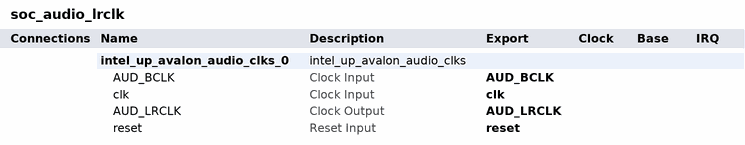
[diagram p0: system contents]
# Platform Designer (Qsys) system soc_audio_lrclk, Cyclone V 5CSEMA5F31C6
# Parameters at their usual value, and those the tool derives, are not listed.
package require qsys
create_system soc_audio_lrclk
set_project_property DEVICE_FAMILY {Cyclone V}
set_project_property DEVICE 5CSEMA5F31C6

add_instance intel_up_avalon_audio_clks_0 intel_up_avalon_audio_clks 18.0
set_instance_property intel_up_avalon_audio_clks_0 AUTO_EXPORT true
set_instance_parameter_value intel_up_avalon_audio_clks_0 dw 24

# exported interfaces
add_interface AUD_BCLK clock sink
set_interface_property AUD_BCLK EXPORT_OF intel_up_avalon_audio_clks_0.AUD_BCLK
add_interface AUD_LRCLK clock source
set_interface_property AUD_LRCLK EXPORT_OF intel_up_avalon_audio_clks_0.AUD_LRCLK
add_interface clk clock sink
set_interface_property clk EXPORT_OF intel_up_avalon_audio_clks_0.clk
add_interface reset reset sink
set_interface_property reset EXPORT_OF intel_up_avalon_audio_clks_0.reset

set_interconnect_requirement {$system} qsys_mm.clockCrossingAdapter HANDSHAKE
set_interconnect_requirement {$system} qsys_mm.enableEccProtection FALSE
set_interconnect_requirement {$system} qsys_mm.insertDefaultSlave FALSE
set_interconnect_requirement {$system} qsys_mm.maxAdditionalLatency 1

save_system soc_audio_lrclk.qsys
